# Altium schematic sheet STM32F103CBT6.SchDoc
size A
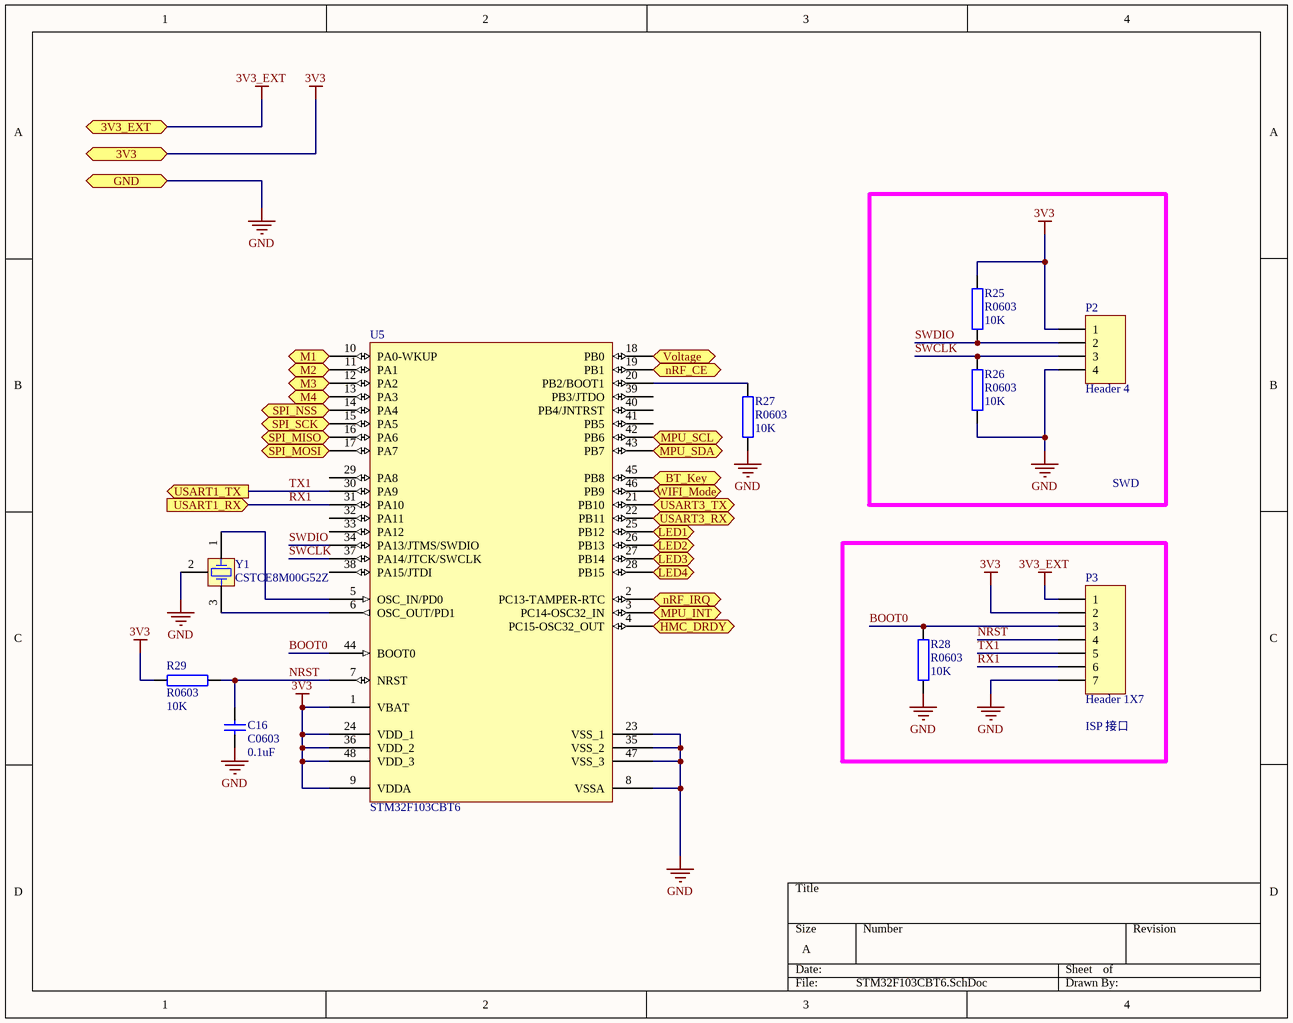
[diagram p0: STM32F103CBT6.SchDoc]

## Parts
C16  C0603  value 0.1uF  [C0603]  (no BOM)
P2  Header 4  [HDR1X4]
P3  Header 1X7  [HDR1X7]
R25  R0603  value 10K  [R0603]
R26  R0603  value 10K  [R0603]
R27  R0603  value 10K  [R0603]
R28  R0603  value 10K  [R0603]
R29  R0603  value 10K  [R0603]
U5  STM32F103CBT6  [LQFP48_N]
Y1  CSTCE8M00G52Z  [X8MCSTCR]

## Blocks framed on the sheet
SWD: P2 R25 R26
ISP 接口: P3 R28

## Ports
3V3, 3V3_EXT, BT_Key (out), GND, HMC_DRDY (in), LED1 (out), LED2 (out), LED3 (out), LED4 (out), M1 (out), M2 (out), M3 (out), M4 (out), MPU_INT (in), MPU_SCL (out), MPU_SDA (bidir), nRF_CE (out), nRF_IRQ (in), SPI_MISO (in), SPI_MOSI (out), SPI_NSS (bidir), SPI_SCK (out), USART1_RX (in), USART1_TX (out), USART3_RX (in), USART3_TX (out), Voltage (in), WIFI_Mode (out)

## Nets
3V3: P2.1 P3.2 R25.2 R29.1 U5.1(VBAT) U5.9(VDDA) U5.24(VDD_1) U5.36(VDD_2) U5.48(VDD_3) ; port 3V3
3V3_EXT: P3.1 ; port 3V3_EXT
GND: C16.1 P2.4 P3.7 R26.1 R27.1 R28.2 U5.8(VSSA) U5.23(VSS_1) U5.35(VSS_2) U5.47(VSS_3) Y1.2(COM) ; port GND
BOOT0: P3.3 R28.1 U5.44(BOOT0)
BT_Key: U5.45(PB8) ; port BT_Key
HMC_DRDY: U5.4(PC15-OSC32_OUT) ; port HMC_DRDY
LED1: U5.25(PB12) ; port LED1
LED2: U5.26(PB13) ; port LED2
LED3: U5.27(PB14) ; port LED3
LED4: U5.28(PB15) ; port LED4
M1: U5.10(PA0-WKUP) ; port M1
M2: U5.11(PA1) ; port M2
M3: U5.12(PA2) ; port M3
M4: U5.13(PA3) ; port M4
MPU_INT: U5.3(PC14-OSC32_IN) ; port MPU_INT
MPU_SCL: U5.42(PB6) ; port MPU_SCL
MPU_SDA: U5.43(PB7) ; port MPU_SDA
nRF_CE: U5.19(PB1) ; port nRF_CE
nRF_IRQ: U5.2(PC13-TAMPER-RTC) ; port nRF_IRQ
NRST: C16.2 P3.4 R29.2 U5.7(NRST)
RX1: P3.6 U5.31(PA10) ; port USART1_RX
SPI_MISO: U5.16(PA6) ; port SPI_MISO
SPI_MOSI: U5.17(PA7) ; port SPI_MOSI
SPI_NSS: U5.14(PA4) ; port SPI_NSS
SPI_SCK: U5.15(PA5) ; port SPI_SCK
SWCLK: P2.3 R26.2 U5.37(PA14/JTCK/SWCLK)
SWDIO: P2.2 R25.1 U5.34(PA13/JTMS/SWDIO)
TX1: P3.5 U5.30(PA9) ; port USART1_TX
USART3_RX: U5.22(PB11) ; port USART3_RX
USART3_TX: U5.21(PB10) ; port USART3_TX
Voltage: U5.18(PB0) ; port Voltage
WIFI_Mode: U5.46(PB9) ; port WIFI_Mode
NetR27_2: R27.2 U5.20(PB2/BOOT1)
NetU5_5: U5.5(OSC_IN/PD0) Y1.1(OSC1)
NetU5_6: U5.6(OSC_OUT/PD1) Y1.3(OSC2)

Not connected (* = marked no-connect by the designer): U5 29(PA8) 32(PA11) 33(PA12) 38(PA15/JTDI) 39(PB3/JTDO) 40(PB4/JNTRST) 41(PB5)

## Library data of the parts
C16 = Cap: Capacitor (Semiconductor SIM Model); Published: 8-Jun-2000; LatestRevisionDate: 29-May-2009; LatestRevisionNote: IPC-7351 Footprint Added.; PackageReference: C0603; Publisher: Altium Limited; PackageDescription: Chip Capacitor
P2 = Header 4: Header, 4-Pin; LatestRevisionDate: 17-Jul-2002; LatestRevisionNote: Re-released for DXP Platform.; Publisher: Altium Limited
P3 = Header 1X7: Header, 7-Pin; LatestRevisionDate: 17-Jul-2002; LatestRevisionNote: Re-released for DXP Platform.; Publisher: Altium Limited
R25-R29 = Res3: Resistor; Published: 8-Jun-2000; LatestRevisionDate: 29-May-2009; LatestRevisionNote: IPC-7351 Footprint Added.; PackageReference: R0603; Publisher: Altium Limited; PackageDescription: Chip Resistor
U5 = STM32F103CBT6: STM32 ARM-based 32-bit MCU with 128 Kbytes Flash, 48-pin LQFP, Industrial Temperature; Published: 30-May-2008; DatasheetVersion: rev6, Mar-2008; PackageVersion: Mar-2008; PackageReference: LQFP48; Publisher: Altium Limited; PackageDescription: 48-Pin Low-Profile Quad Flat Pack, 7 x 7 mm Body, 0.5 mm Pitch (LQFP48); ComponentLink1Description: Manufacturer Link; ComponentLink1URL: www.st.com/stm32; ComponentLink2Description: Datasheet; ComponentLink2URL: http://www.st.com/stonline/products/literature/ds/13587.pdf
Y1 = CSTCE8M00G52Z: Crystal Oscillator, 3rd In-Line Lead Version